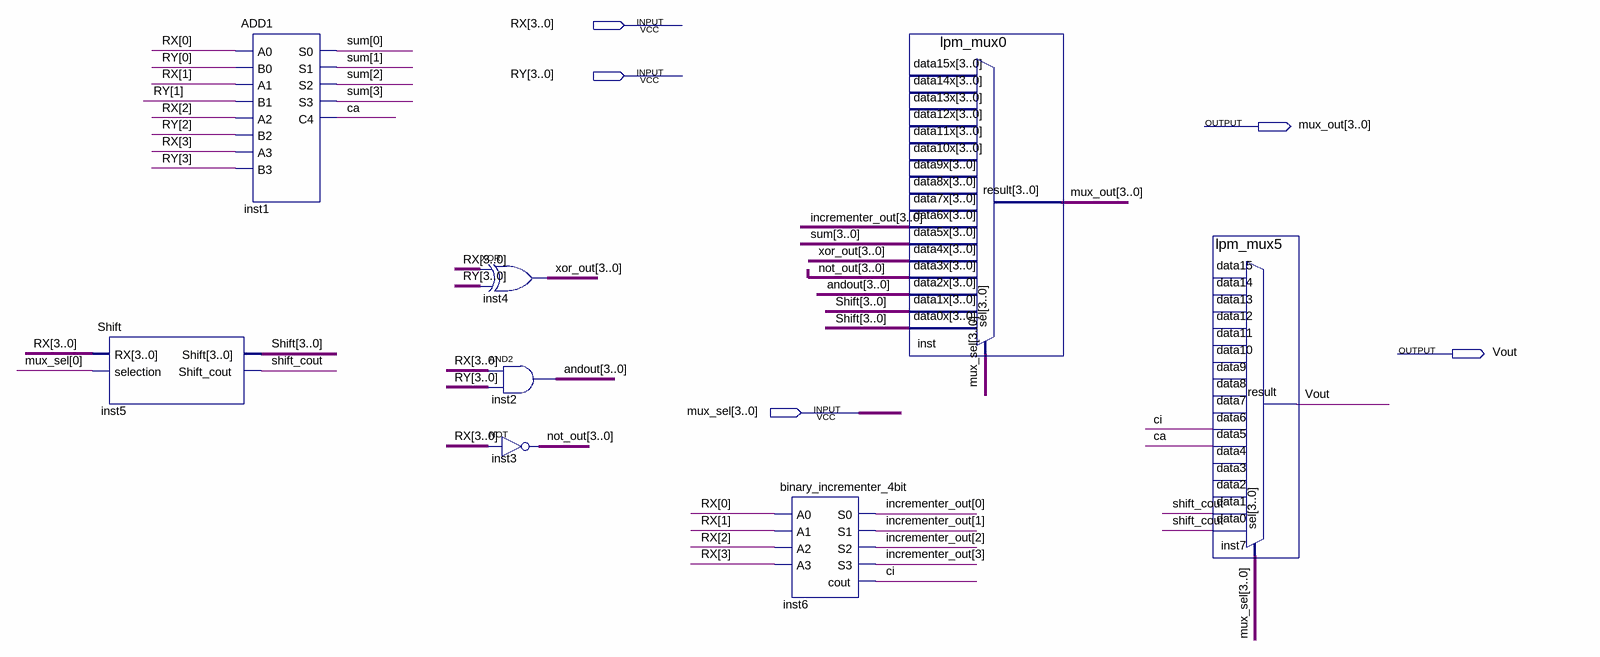
[diagram p0: schematic sheet]
// Quartus schematic 1.bdf as structural Verilog: 8 symbols, 5 pins
module \1  (
  input  [3:0] RX,
  input  [3:0] RY,
  input  [3:0] mux_sel,
  output [3:0] mux_out,
  output Vout
);

  wire ca, ci, shift_cout;
  wire [3:0] andout, incrementer_out, not_out, Shift, sum, xor_out;

  Shift inst5 (.RX(RX), .selection(mux_sel[0]), .Shift(Shift), .Shift_cout(shift_cout));
  ADD1 inst1 (
    .A0(RX[0]), .B0(RY[0]), .A1(RX[1]), .B1(RY[1]), .A2(RX[2]), .B2(RY[2]), .A3(RX[3]), .B3(RY[3]),
    .S0(sum[0]), .S1(sum[1]), .S2(sum[2]), .S3(sum[3]), .C4(ca));
  assign xor_out = RX ^ RY;  // XOR inst4, 4 bits wide
  assign andout = RX & RY;  // AND2 inst2, 4 bits wide
  assign not_out = ~RX;  // NOT inst3, 4 bits wide
  binary_incrementer_4bit inst6 (
    .A0(RX[0]), .A1(RX[1]), .A2(RX[2]), .A3(RX[3]), .S0(incrementer_out[0]), .S1(incrementer_out[1]),
    .S2(incrementer_out[2]), .S3(incrementer_out[3]), .cout(ci));
  lpm_mux0 inst (
    .data6x(incrementer_out), .data5x(sum), .data4x(xor_out), .data3x(not_out), .data2x(andout),
    .data1x(Shift), .data0x(Shift), .sel(mux_sel), .result(mux_out));  // open: data15x, data14x, data13x, data12x, data11x, data10x, data9x, data8x, data7x
  lpm_mux5 inst7 (
    .data6(ci), .data5(ca), .data1(shift_cout), .data0(shift_cout), .sel(mux_sel), .result(Vout));  // open: data15, data14, data13, data12, data11, data10, data9, data8, data7, data4, data3, data2
endmodule
